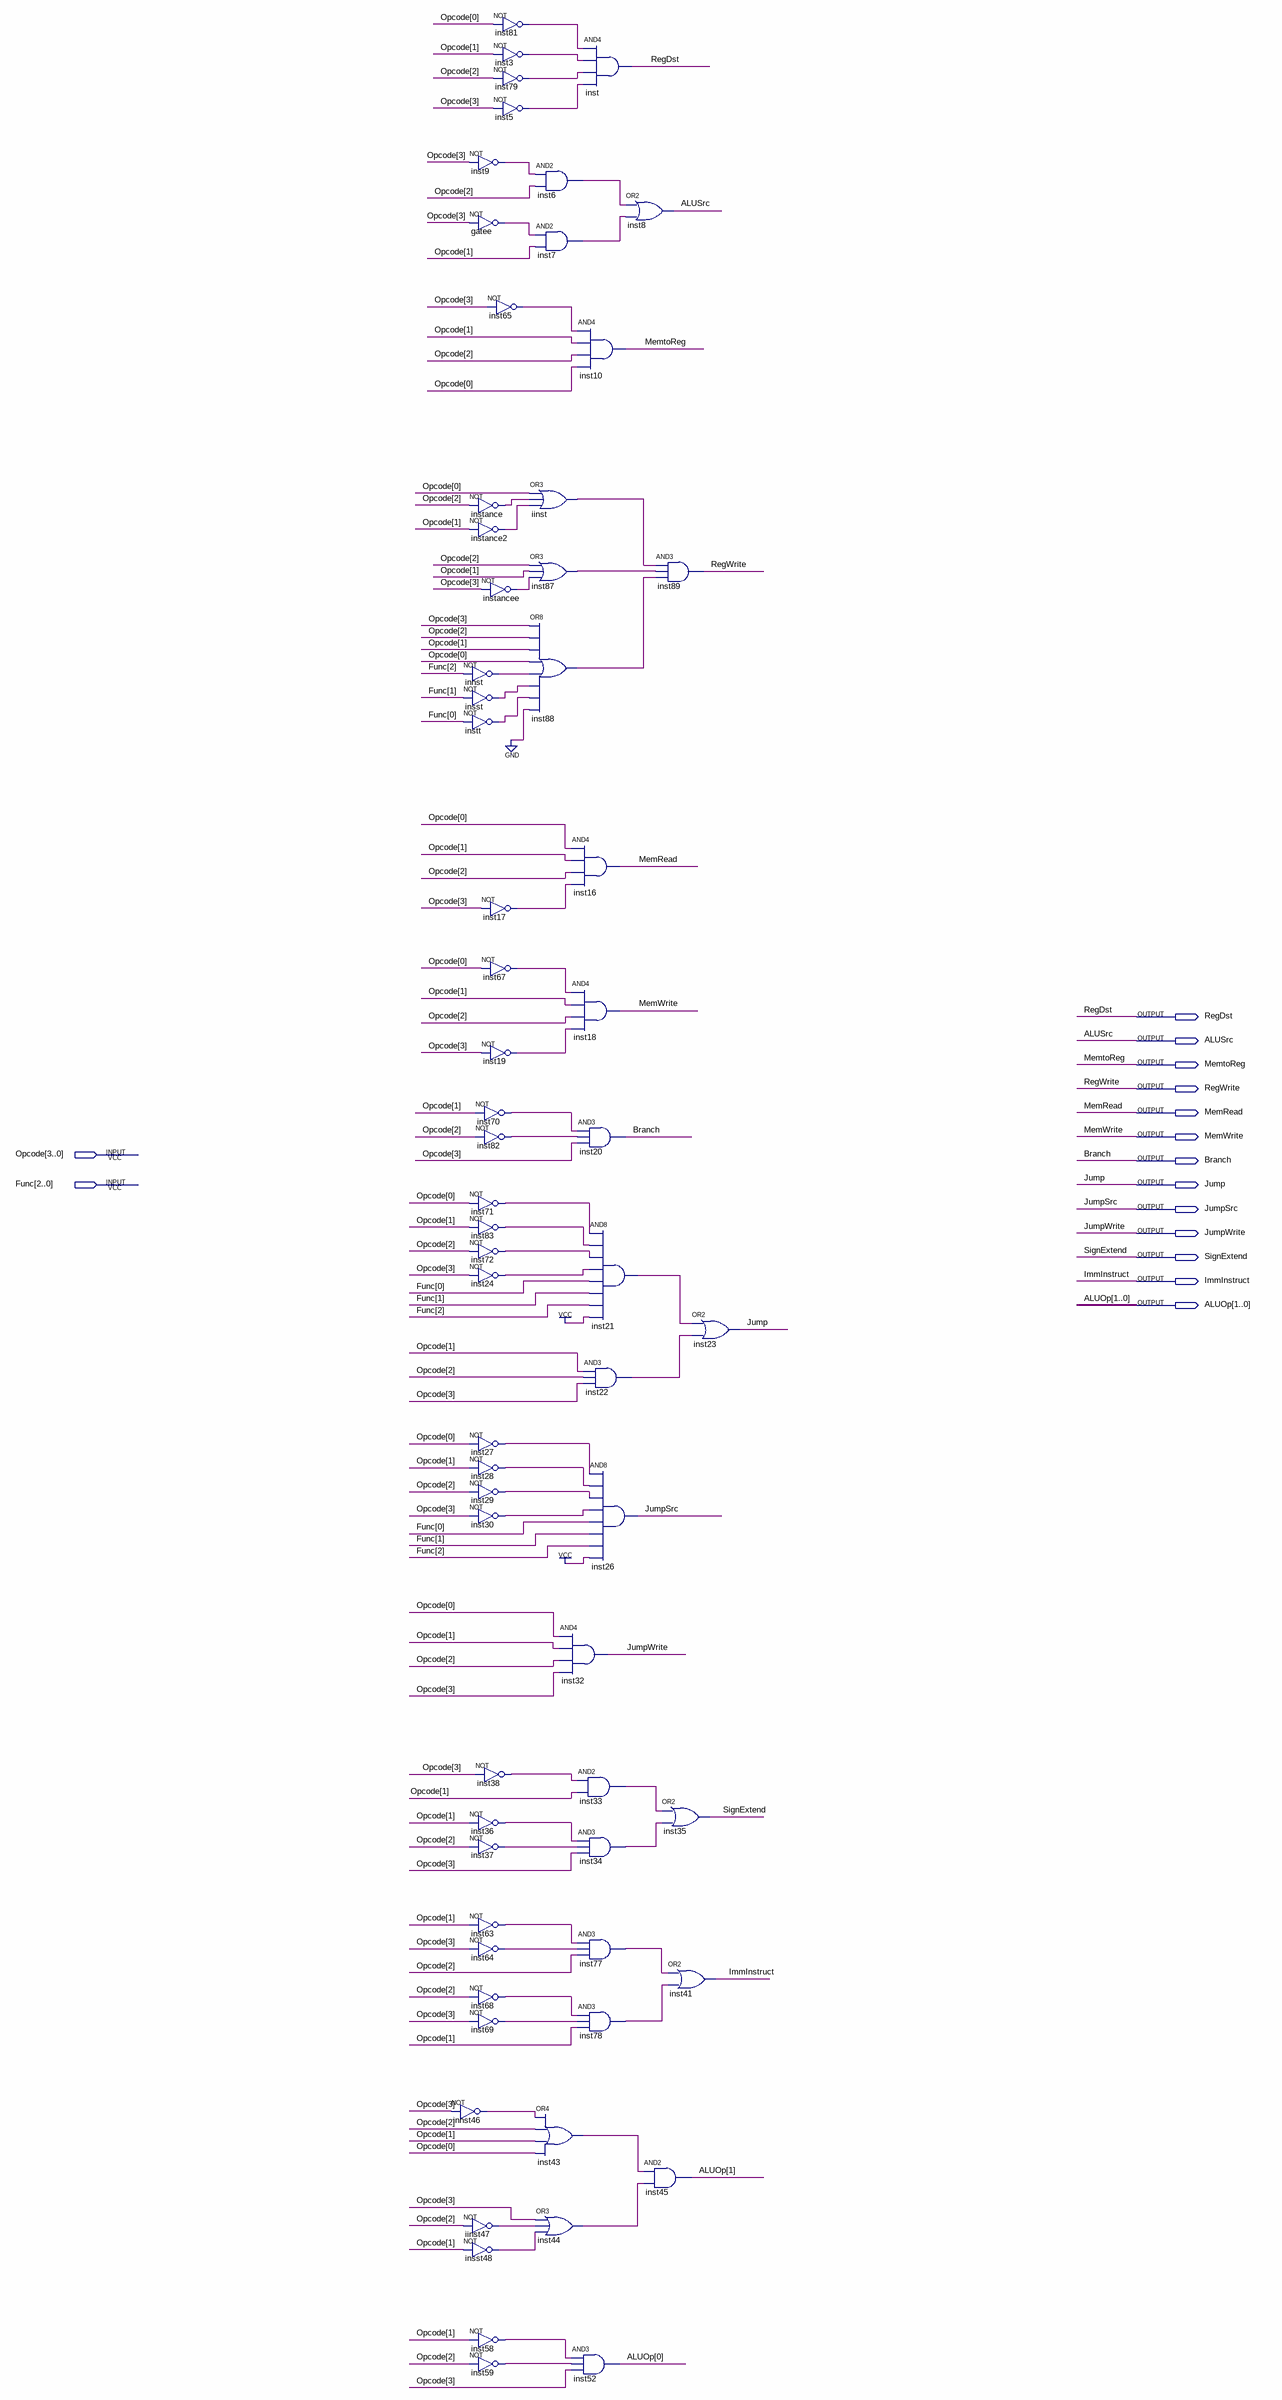
[diagram p0: schematic sheet]
// Quartus schematic ControlUnit.bdf as structural Verilog: 65 symbols, 15 pins
module ControlUnit (
  input  [3:0] Opcode,
  input  [2:0] Func,
  output RegDst,
  output ALUSrc,
  output MemtoReg,
  output RegWrite,
  output MemRead,
  output MemWrite,
  output Branch,
  output Jump,
  output JumpSrc,
  output JumpWrite,
  output SignExtend,
  output ImmInstruct,
  output [1:0] ALUOp
);

  wire gatee_out, iinst47_out, iinst_out, innst46_out, innst_out, insst48_out, insst_out, inst3_out,
       inst5_out, inst6_out, inst7_out, inst9_out, inst17_out, inst19_out, inst21_out, inst22_out,
       inst24_out, inst27_out, inst28_out, inst29_out, inst30_out, inst33_out, inst34_out, inst36_out,
       inst37_out, inst38_out, inst43_out, inst44_out, inst58_out, inst59_out, inst63_out, inst64_out,
       inst65_out, inst67_out, inst68_out, inst69_out, inst70_out, inst71_out, inst72_out, inst77_out,
       inst78_out, inst79_out, inst81_out, inst82_out, inst83_out, inst87_out, inst88_out, instance2_out,
       instance_out, instancee_out, instt_out;

  not inst9 (inst9_out, Opcode[3]);
  not gatee (gatee_out, Opcode[3]);
  not \instance  (instance_out, Opcode[2]);
  not instance2 (instance2_out, Opcode[1]);
  not instancee (instancee_out, Opcode[3]);
  not innst (innst_out, Func[2]);
  not insst (insst_out, Func[1]);
  not instt (instt_out, Func[0]);
  not inst17 (inst17_out, Opcode[3]);
  not inst67 (inst67_out, Opcode[0]);
  not inst19 (inst19_out, Opcode[3]);
  not inst70 (inst70_out, Opcode[1]);
  not inst82 (inst82_out, Opcode[2]);
  not inst71 (inst71_out, Opcode[0]);
  not inst83 (inst83_out, Opcode[1]);
  not inst72 (inst72_out, Opcode[2]);
  not inst24 (inst24_out, Opcode[3]);
  not inst27 (inst27_out, Opcode[0]);
  not inst28 (inst28_out, Opcode[1]);
  not inst29 (inst29_out, Opcode[2]);
  not inst30 (inst30_out, Opcode[3]);
  not inst38 (inst38_out, Opcode[3]);
  not inst36 (inst36_out, Opcode[1]);
  not inst37 (inst37_out, Opcode[2]);
  not inst63 (inst63_out, Opcode[1]);
  not inst64 (inst64_out, Opcode[3]);
  not inst68 (inst68_out, Opcode[2]);
  not inst69 (inst69_out, Opcode[3]);
  not innst46 (innst46_out, Opcode[3]);
  not iinst47 (iinst47_out, Opcode[2]);
  not insst48 (insst48_out, Opcode[1]);
  not inst58 (inst58_out, Opcode[1]);
  not inst59 (inst59_out, Opcode[2]);
  not inst81 (inst81_out, Opcode[0]);
  not inst3 (inst3_out, Opcode[1]);
  not inst79 (inst79_out, Opcode[2]);
  not inst5 (inst5_out, Opcode[3]);
  not inst65 (inst65_out, Opcode[3]);
  or iinst (iinst_out, Opcode[0], instance_out, instance2_out);
  or inst87 (inst87_out, Opcode[2], Opcode[1], instancee_out);
  or inst88 (inst88_out, Opcode[3], Opcode[2], Opcode[1], Opcode[0], innst_out, insst_out, instt_out, 1'b0);
  and inst6 (inst6_out, inst9_out, Opcode[2]);
  and inst7 (inst7_out, gatee_out, Opcode[1]);
  and inst10 (MemtoReg, inst65_out, Opcode[1], Opcode[2], Opcode[0]);
  and inst16 (MemRead, Opcode[0], Opcode[1], Opcode[2], inst17_out);
  and inst18 (MemWrite, inst67_out, Opcode[1], Opcode[2], inst19_out);
  and inst20 (Branch, inst70_out, inst82_out, Opcode[3]);
  and inst32 (JumpWrite, Opcode[0], Opcode[1], Opcode[2], Opcode[3]);
  and inst33 (inst33_out, inst38_out, Opcode[1]);
  and inst34 (inst34_out, inst36_out, inst37_out, Opcode[3]);
  and inst77 (inst77_out, inst63_out, inst64_out, Opcode[2]);
  and inst78 (inst78_out, inst68_out, inst69_out, Opcode[1]);
  or inst43 (inst43_out, innst46_out, Opcode[2], Opcode[1], Opcode[0]);
  or inst44 (inst44_out, Opcode[3], iinst47_out, insst48_out);
  and inst52 (ALUOp[0], inst58_out, inst59_out, Opcode[3]);
  and inst (RegDst, inst81_out, inst3_out, inst79_out, inst5_out);
  or inst8 (ALUSrc, inst6_out, inst7_out);
  and inst21 (inst21_out, inst71_out, inst83_out, inst72_out, inst24_out, Func[0], Func[1], Func[2], 1'b1);
  and inst22 (inst22_out, Opcode[1], Opcode[2], Opcode[3]);
  and inst26 (JumpSrc, inst27_out, inst28_out, inst29_out, inst30_out, Func[0], Func[1], Func[2], 1'b1);
  and inst89 (RegWrite, iinst_out, inst87_out, inst88_out);
  or inst35 (SignExtend, inst33_out, inst34_out);
  or inst41 (ImmInstruct, inst77_out, inst78_out);
  and inst45 (ALUOp[1], inst43_out, inst44_out);
  or inst23 (Jump, inst21_out, inst22_out);
endmodule
